# EAGLE design 5V3AUSB (EAGLE 6.5.0)
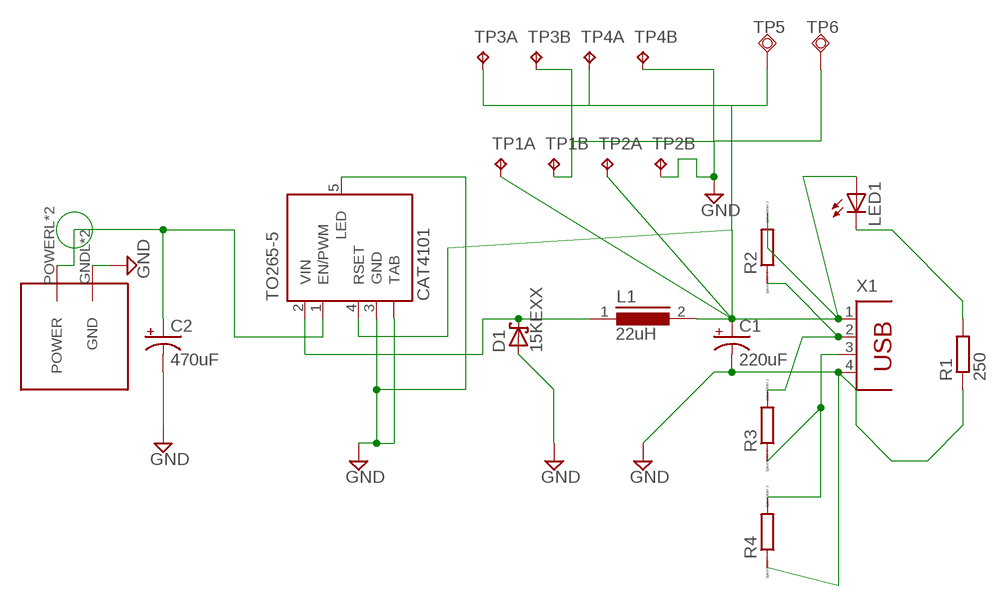
[diagram p0: schematic, sheet 1]

## Parts
C1  220uF  CPOL-USE2.5-6  [E2,5-6]
C2  470uF  CPOL-USE2.5-6  [E2,5-6]
D1  15KEXX  [CB429-17]
L1  22uH  B82133  [SUKW3-27]
LED1  LEDCHIPLED_1206  [CHIPLED_1206]
R1  250  R-EU_R1206  [R1206]
R2  R0204/7  [0204/7]
R3  R0204/7  [0204/7]
R4  R0204/7  [0204/7]
TO265-5  CAT4101  [TO263_5]
TP1  TP2P2-38-20  [P2-38-20]
TP2  TP2P2-38-20  [P2-38-20]
TP3  TP2P2-38-20  [P2-38-20]
TP4  TP2P2-38-20  [P2-38-20]
TP5  TPSQTP20R  [TP20R]
TP6  TPSQTP20R  [TP20R]
U$1  2X2-MOLEX  [2X2MOLEX]
X1  PN87520  [PN87520]

## Nets
GND: C1.- C2.- D1.A R1.1 R4.1 TO265-5.3(GND) TO265-5.5(LED) TO265-5.TAB TP1.TP-2 TP2.TP-2 TP3.TP-2 TP4.TP-2 TP6.TP U$1.GNDL(GND) U$1.GNDR(GND) X1.4
N$1: C2.+ TO265-5.1(EN/PWM) U$1.POWERL(POWER) U$1.POWERR(POWER)
N$2: D1.C L1.1 TO265-5.2(VIN)
N$3: C1.+ L1.2 LED1.A R2.2 TO265-5.4(RSET) TP1.TP-1 TP2.TP-1 TP3.TP-1 TP4.TP-1 TP5.TP X1.1
N$5: LED1.C R1.2
N$6: R3.1 R4.2 X1.3
N$7: R2.1 R3.2 X1.2

## Library data of the parts
C1 C2 = resistor:CPOL-US: POLARIZED CAPACITOR, American symbol
D1 = diode:15KEXX: DIODE
L1 = inductors:B82133: INDUCTOR
LED1 = led:LED: LED OSRAM: - CHIPLED LG R971, LG N971, LY N971, LG Q971, LY Q971, LO R971, LY R971 LH N974, LH R974 LS Q976, LO Q976, LY Q976 LO Q996 - Hyper CHIPLED LW Q18S LB Q993, LB Q99A, LB R99A - SideLED LS A670, LO A670, LY A670, LG A670, LP A670 LB A673, LV A673, LT A673, LW A673 LH A674 LY A675 LS A676, LA A676, LO A676, LY A676, LW A676 LS A679, LY A679, LG A679 - Hyper Micro SIDELED® LS Y876, LA Y876, LO Y876, LY Y876 LT Y87S - SmartLED LW L88C, LW L88S LB L89C, LB L89S, LG L890 LS L89K, LO L89K, LY L89K LS L896, LA L896, LO L896, LY L896 - TOPLED LS T670, LO T670, LY T670, LG T670, LP T670 LSG T670, LSP T670, LSY T670, LOP T670, LYG T670 LG T671, LOG T671, LSG T671 LB T673, LV T673, LT T673, LW T673 LH T674 LS T676, LA T676, LO T676, LY T676, LB T676, LH T676, LSB T676, LW T676 LB T67C, LV T67C, LT T67C, LS T67K, LO T67K, LY T67K, LW E67C LS E67B, LA E67B, LO E67B, LY E67B, LB E67C, LV E67C, LT E67C LW T67C LS T679, LY T679, LG T679 LS T770, LO T770, LY T770, LG T770, LP T770 LB T773, LV T773, LT T773, LW T773 LH T774 LS E675, LA E675, LY E675, LS T675 LS T776, LA T776, LO T776, LY T776, LB T776 LHGB T686 LT T68C, LB T68C - Hyper Mini TOPLED® LB M676 - Mini TOPLED Santana® LG M470 LS M47K, LO M47K, LY M47K Source: http://www.osram.convergy.de LUXEON: - LUMILED® LXK2-PW12-R00, LXK2-PW12-S00, LXK2-PW14-U00, LXK2-PW14-V00 LXK2-PM12-R00, LXK2-PM12-S00, LXK2-PM14-U00 LXK2-PE12-Q00, LXK2-PE12-R00, LXK2-PE12-S00, LXK2-PE14-T00, LXK2-PE14-U00 LXK2-PB12-K00, LXK2-PB12-L00, LXK2-PB12-M00, LXK2-PB14-N00, LXK2-PB14-P00, LXK2-PB14-Q00 LXK2-PR12-L00, LXK2-PR12-M00, LXK2-PR14-Q00, LXK2-PR14-R00 LXK2-PD12-Q00, LXK2-PD12-R00, LXK2-PD12-S00 LXK2-PH12-R00, LXK2-PH12-S00 LXK2-PL12-P00, LXK2-PL12-Q00, LXK2-PL12-R00 Source: www.luxeon.com KINGBRIGHT: KA-3528ASYC Source: www.kingbright.com
R1 = resistor:R-EU_: RESISTOR, European symbol
R2-R4 = eagle-ltspice:R: RESISTOR, European symbol; SPICEMODEL: NONE; SPICEPREFIX: R
TO265-5 = on-semiconductor:CAT4101: 1A Constant-Current LED Driver with PWM Dimming Source: ON Semiconductor .. 4101.pdf; MPN: CAT4101TV-T75; OC_FARNELL: 1718452; OC_NEWARK: 08R5264
TP1-TP4 = testpad:TP2: Test pad
TP5 TP6 = testpad:TPSQ: Test pad
U$1 = Molex:2X2-MOLEX
X1 = con-berg:PN87520: BERG USB connector; OC_FARNELL: unknown; OC_NEWARK: unknown

## Board
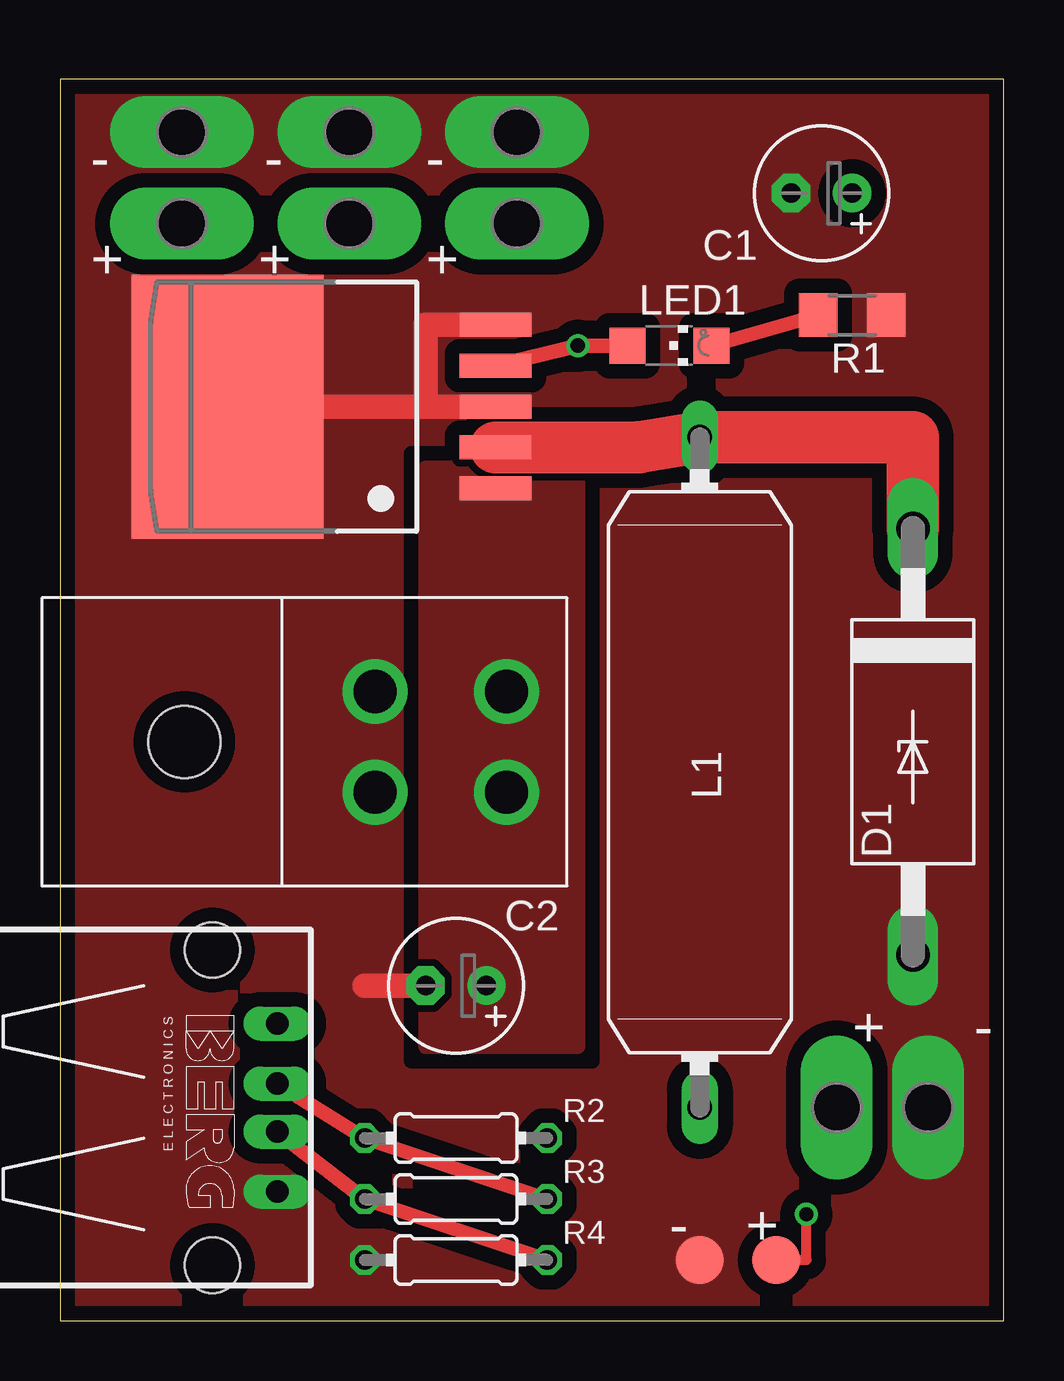
[diagram p1: board, top side]
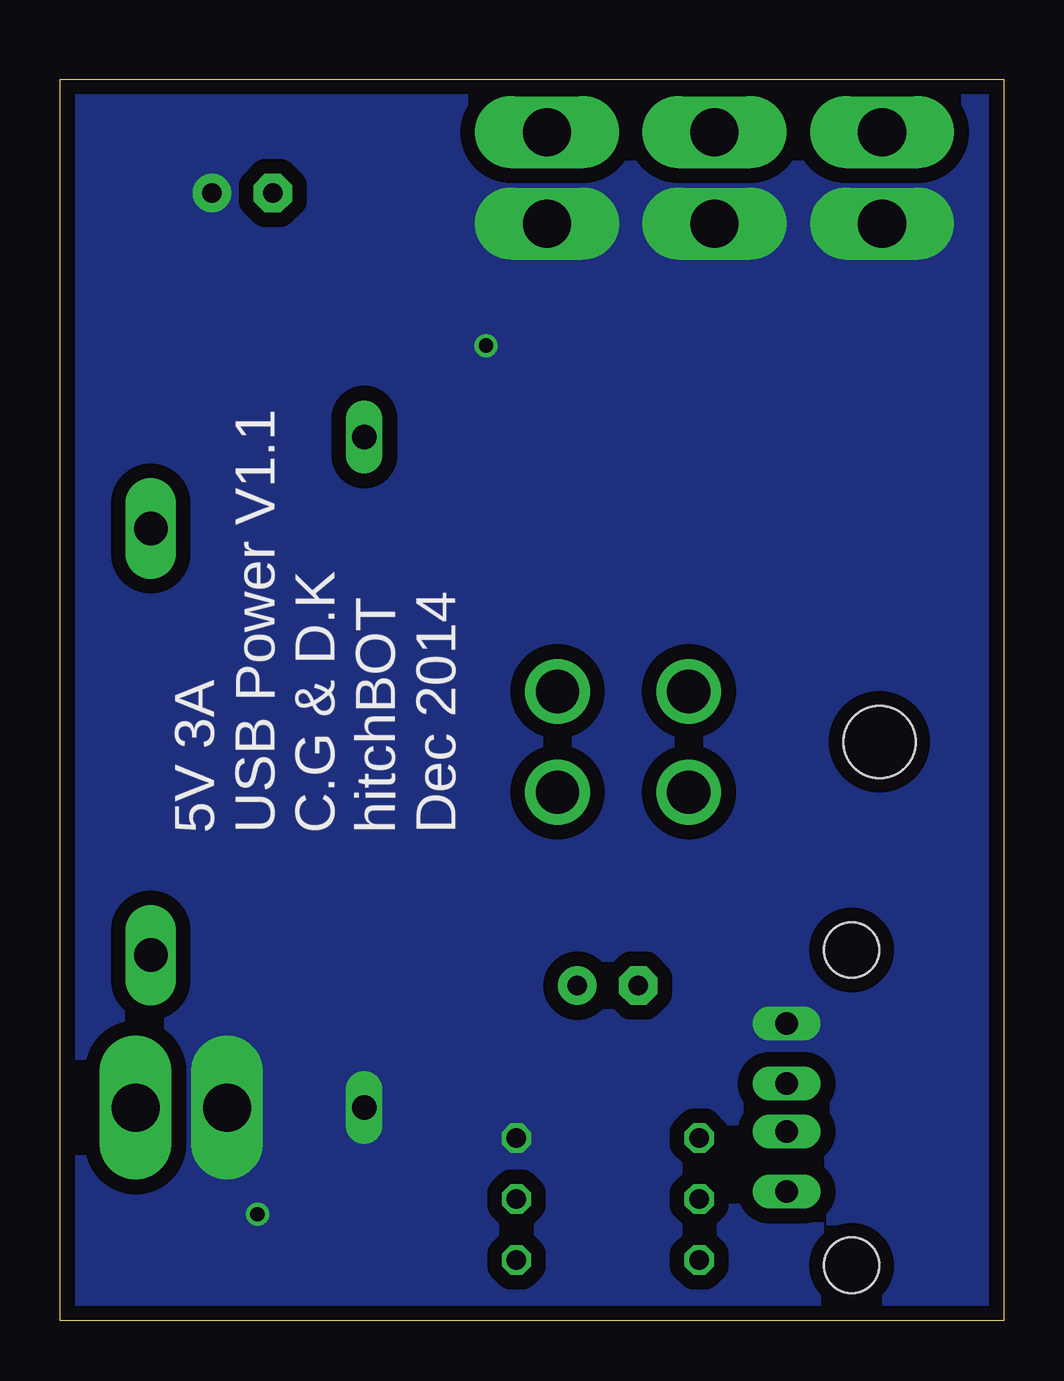
[diagram p2: board, bottom side, seen from below]

Size 39.35 x 51.74 mm. Coordinates in mm from the lower left corner, seen from the top.
Outline: 0,0 39.35,0 39.35,51.74 0,51.74 0,0
Copper layers (1*16): Top 0.0356mm / dielectric 1.5011mm / Bottom 0.0356mm
Design rules "LaenPCBOrder": minimum track width 6mil, minimum drill 13mil, track to track 6mil, track to pad 6mil, pad to pad 6mil, via to via 6mil, smd to smd 6mil, copper to edge 15mil, drill to drill 6mil, minimum pad ring 7mil, minimum via ring 7mil, stop-mask expansion 3mil, vias tented up to drill 0mil, thermal gap 10mil

### Footprints (pad centres in the part's own frame; a part is rotated, then mirrored left to right if it is on the bottom)
E2,5-6 = drill 0.813 pad 1.6: + -1.27,0 | drill 0.813 pad 1.6 octagon: - 1.27,0
CB429-17 = drill 1.397 long: A 8.89,0; C -8.89,0
SUKW3-27 = drill 1.016 long: 1 -13.97,0; 2 13.97,0
CHIPLED_1206 = smd 1.5 x 1.5: A 0,-1.75; C 0,1.75
R1206 = smd 1.6 x 1.803: 1 -1.422,0; 2 1.422,0
0204/7 = drill 0.813 octagon: 1 -3.81,0; 2 3.81,0
TO263_5 = smd 1 x 3: 1 -3.4,-8; 2 -1.7,-8; 3 0,-8; 4 1.7,-8; 5 3.4,-8 | smd 11 x 8: TAB 0,3.175
P2-38-20 = drill 2.007 pad 2.54 long: TP-1 -1.905,0; TP-2 1.905,0
TP20R = smd 2 x 2: TP 0,0
2X2MOLEX = drill 1.8: GNDL -2.1,-2.1; GNDR 2.1,-2.1; POWERL -2.1,3.37; POWERR 2.1,3.37 | hole 3: 0,-10.05
PN87520 = drill 0.95 long: 1 -3.5,2.71; 2 -1,2.71; 3 1,2.71; 4 3.5,2.71 | hole 2.3: -6.57,0; 6.57,0

### Placement (x,y rotation side)
C1  31.75,46.99 180 top
C2  16.51,13.97 180 top
D1  35.56,24.13 270 top
L1  26.67,22.86 270 top
LED1  25.4,40.64 270 top
R1  33.02,41.91 180 top
R2  16.51,7.62 0 top
R3  16.51,5.08 0 top
R4  16.51,2.54 0 top
TO265-5  10.16,38.1 90 top
TP1  5.08,47.62 90 top
TP2  12.06,47.62 90 top
TP3  34.29,8.89 0 top
TP4  19.05,47.62 90 top
TP5  29.84,2.54 0 top
TP6  26.67,2.54 0 top
U$1  15.24,24.13 270 top
X1  6.35,8.89 270 top

### Tracks (layer width: path | path; a pad name or v marks a point on that pad's centre or on a via)
GND
  Top 1.016: TO265-5.5 15.24,41.5 15.24,38.1 | 15.24,38.1 TO265-5.3 | TO265-5.TAB 15.24,38.1 | C2.- 12.7,13.97
  pour Top (isolate 0.61, rank 2, no thermals): 0,52.07 39.37,52.07 39.37,0 0,0
N$1
  pour Top (isolate 0.305, no thermals): 15.24,35.56 15.24,11.43 21.59,11.43 21.59,35.56
N$2
  Top 2.159: TO265-5.2 24.13,36.4
  Top 2.184: 24.13,36.4 L1.1 35.56,36.83 D1.C
N$3  (via drill 0.6)
  Top 0.406: TP5.TP 31.11,2.54 v31.11,4.45
  Top 0.61: TO265-5.4 v21.59,40.64 LED1.A
  pour Bottom (isolate 0.61, no thermals): 0,52.07 39.37,51.82 39.37,-0.25 0,0
N$5
  Top 0.61: LED1.C R1.2
N$6
  Top 0.61: R4.2 R3.1 X1.3
N$7
  Top 0.61: R3.2 R2.1 X1.2

### Text on the board
tPlace: - | - | - | + | + | + | + | - | - | +
bPlace: 5V 3A / USB Power V1.1 / C.G & D.K / hitchBOT / Dec 2014